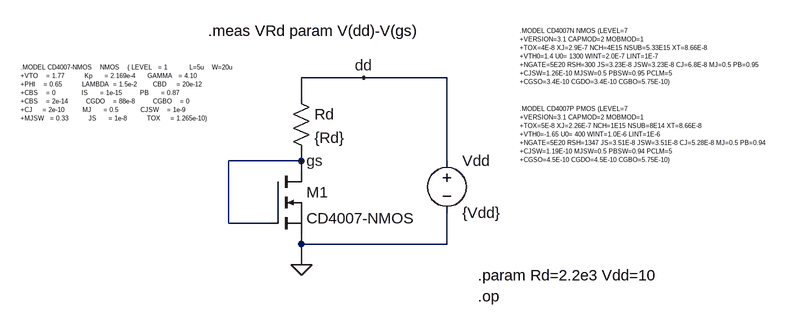
[diagram p0: schematic LAB11a.asc]
LAB11a.asc, the LTspice schematic file:
Version 4
SHEET 1 944 680
WIRE 304 -16 208 -16
WIRE 432 -16 304 -16
WIRE 208 16 208 -16
WIRE 208 112 208 96
WIRE 208 112 96 112
WIRE 432 112 432 -16
WIRE 208 128 208 112
WIRE 96 208 96 112
WIRE 160 208 96 208
WIRE 208 240 208 224
WIRE 432 240 432 192
WIRE 432 240 208 240
WIRE 208 272 208 240
FLAG 208 272 0
FLAG 208 112 gs
FLAG 304 -16 dd
SYMBOL res 192 0 R0
SYMATTR InstName Rd
SYMATTR Value {Rd}
SYMBOL voltage 432 96 R0
WINDOW 123 0 0 Left 0
WINDOW 39 0 0 Left 0
SYMATTR InstName Vdd
SYMATTR Value {Vdd}
SYMBOL nmos 160 128 R0
SYMATTR InstName M1
SYMATTR Value CD4007-NMOS
TEXT 480 320 Left 2 !.op
TEXT 480 288 Left 2 !.param Rd=2.2e3 Vdd=10
TEXT 544 -88 Left 0 !.MODEL CD4007N NMOS (LEVEL=7\n+VERSION=3.1 CAPMOD=2 MOBMOD=1\n+TOX=4E-8 XJ=2.9E-7 NCH=4E15 NSUB=5.33E15 XT=8.66E-8 \n+VTH0=1.4 U0= 1300 WINT=2.0E-7 LINT=1E-7 \n+NGATE=5E20 RSH=300 JS=3.23E-8 JSW=3.23E-8 CJ=6.8E-8 MJ=0.5 PB=0.95\n+CJSW=1.26E-10 MJSW=0.5 PBSW=0.95 PCLM=5\n+CGSO=3.4E-10 CGDO=3.4E-10 CGBO=5.75E-10)
TEXT 544 32 Left 0 !.MODEL CD4007P PMOS (LEVEL=7\n+VERSION=3.1 CAPMOD=2 MOBMOD=1\n+TOX=5E-8 XJ=2.26E-7 NCH=1E15 NSUB=8E14 XT=8.66E-8\n+VTH0=-1.65 U0= 400 WINT=1.0E-6 LINT=1E-6\n+NGATE=5E20 RSH=1347 JS=3.51E-8 JSW=3.51E-8 CJ=5.28E-8 MJ=0.5 PB=0.94\n+CJSW=1.19E-10 MJSW=0.5 PBSW=0.94 PCLM=5\n+CGSO=4.5E-10 CGDO=4.5E-10 CGBO=5.75E-10)
TEXT 64 -88 Left 2 !.meas VRd param V(dd)-V(gs)
TEXT -224 -32 Left 0 !.MODEL CD4007-NMOS    NMOS    ( LEVEL   = 1           L=5u    W=20u             \n+VTO    = 1.77          Kp      = 2.169e-4      GAMMA   = 4.10  \n+PHI    = 0.65          LAMBDA  = 1.5e-2        CBD     = 20e-12\n+CBS    = 0             IS      = 1e-15         PB      = 0.87\n+CBS    = 2e-14         CGDO    = 88e-8         CGBO    = 0\n+CJ     = 2e-10         MJ      = 0.5           CJSW    = 1e-9\n+MJSW   = 0.33          JS      = 1e-8          TOX     = 1.265e-10)

The netlist it stands for:
* LAB11a.asc
Rd dd gs {Rd}
Vdd dd 0 {Vdd}
M1 gs gs 0 0 CD4007-NMOS
.model NMOS NMOS
.model PMOS PMOS
.lib standard.mos
.op
.param Rd=2.2e3 Vdd=10
.MODEL CD4007N NMOS (LEVEL=7
+VERSION=3.1 CAPMOD=2 MOBMOD=1
+TOX=4E-8 XJ=2.9E-7 NCH=4E15 NSUB=5.33E15 XT=8.66E-8
+VTH0=1.4 U0= 1300 WINT=2.0E-7 LINT=1E-7
+NGATE=5E20 RSH=300 JS=3.23E-8 JSW=3.23E-8 CJ=6.8E-8 MJ=0.5 PB=0.95
+CJSW=1.26E-10 MJSW=0.5 PBSW=0.95 PCLM=5
+CGSO=3.4E-10 CGDO=3.4E-10 CGBO=5.75E-10)
.MODEL CD4007P PMOS (LEVEL=7
+VERSION=3.1 CAPMOD=2 MOBMOD=1
+TOX=5E-8 XJ=2.26E-7 NCH=1E15 NSUB=8E14 XT=8.66E-8
+VTH0=-1.65 U0= 400 WINT=1.0E-6 LINT=1E-6
+NGATE=5E20 RSH=1347 JS=3.51E-8 JSW=3.51E-8 CJ=5.28E-8 MJ=0.5 PB=0.94
+CJSW=1.19E-10 MJSW=0.5 PBSW=0.94 PCLM=5
+CGSO=4.5E-10 CGDO=4.5E-10 CGBO=5.75E-10)
.meas VRd param V(dd)-V(gs)
.MODEL CD4007-NMOS    NMOS    ( LEVEL   = 1           L=5u    W=20u
+VTO    = 1.77          Kp      = 2.169e-4      GAMMA   = 4.10
+PHI    = 0.65          LAMBDA  = 1.5e-2        CBD     = 20e-12
+CBS    = 0             IS      = 1e-15         PB      = 0.87
+CBS    = 2e-14         CGDO    = 88e-8         CGBO    = 0
+CJ     = 2e-10         MJ      = 0.5           CJSW    = 1e-9
+MJSW   = 0.33          JS      = 1e-8          TOX     = 1.265e-10)
.backanno
.end